# Altium schematic sheet Power.SchDoc
size A; ENG_APP_DATE: --/--/--; DSN_APP_DATE: --/--/--; CHK_APP_DATE: --/--/--; Organization: My Company; Address1: Address Line 1; Address2: Address Line 2; Address3: Address Line 3; Address4: Address Line 4; SheetNumber: 1; SheetTotal: 3
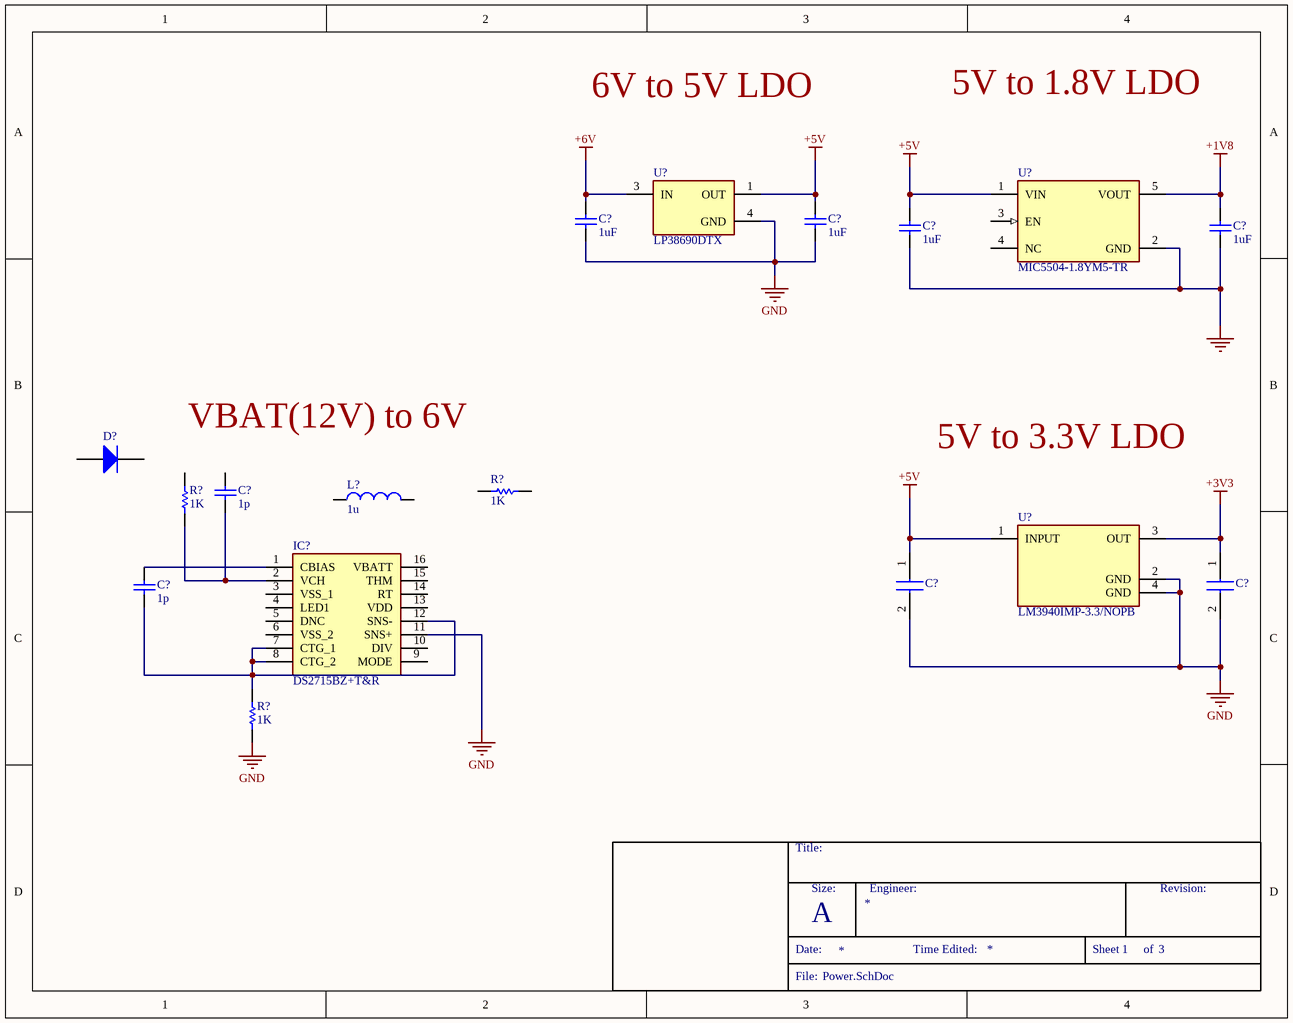
[diagram p0: Power.SchDoc]

## Parts
(Parts that share a designator on the sheet are numbered #1, #2 ... from top to bottom, then left to right.)
C?#1  1uF  [CAPC1608X87X35LL15T15]
C?#2  1uF  [CAPC1608X87X35LL15T15]
C?#3  1uF  [CAPC1608X87X35LL15T15]
C?#4  1uF  [CAPC1608X87X35LL15T15]
C?#5  value 1p  (hidden comment: Capacitor)
C?#6  C2012X5R0J336M125AC  [CAPC2012X145N]  (value not drawn)
C?#7  C2012X5R0J336M125AC  [CAPC2012X145N]  (value not drawn)
C?#8  value 1p  (hidden comment: Capacitor)
D?  Diode  (value not drawn)
IC?  DS2715BZ+T&R  [SOIC127P1032X265-16N]
L?  value 1u  (hidden comment: Inductor)
R?#1  value 1K  (hidden comment: Resistor)
R?#2  value 1K  (hidden comment: Resistor)
R?#3  value 1K  (hidden comment: Resistor)
U?#1  LP38690DTX  [FP-NDP0003B-MFG]
U?#2  MIC5504-1.8YM5-TR  [FP-SOT23-5LD-PL-1-MFG]
U?#3  LM3940IMP-3.3/NOPB  [FP-DCY0004A-MFG]

## Nets
+1V8: C?#4.2 U?#2.5(VOUT)
+3V3: C?#7.1 U?#3.3(OUT)
+5V: C?#2.2 C?#3.2 C?#6.1 U?#1.1(OUT) U?#2.1(VIN) U?#3.1(INPUT)
+6V: C?#1.2 U?#1.3(IN)
GND: C?#1.1 C?#2.1 C?#3.1 C?#4.1 C?#6.2 C?#7.2 IC?.11(SNS+) R?#3.1 U?#1.4(GND) U?#2.2(GND) U?#3.2(GND) U?#3.4(GND)
NetC?#5_1: C?#5.1 IC?.2(VCH) R?#2.1
NetC?#8_1: C?#8.1 IC?.7(CTG_1) IC?.8(CTG_2) IC?.12(SNS-) R?#3.2
NetC?#8_2: C?#8.2 IC?.1(CBIAS)

Not connected (* = marked no-connect by the designer): C?#5 2; D? 1(A) 2(K); IC? 3(VSS_1) 4(LED1) 5(DNC) 6(VSS_2) 9(MODE) 10(DIV) 13(VDD) 14(RT) 15(THM) 16(VBATT); L? 1 2; R?#1 1 2; R?#2 2; U?#2 3(EN) 4(NC)

## Notes on the sheet
- 6V to 5V LDO
- 5V to 1.8V LDO
- VBAT(12V) to 6V
- 5V to 3.3V LDO
- Title:
- Size:
- Engineer:
- Revision:
- Date:
- A
- Time Edited:
- Sheet
- of
- File:

## Library data of the parts
C?#1-C?#4 = CMP-2006-03713-1: Part Number: C0603C105K3RACTU; Manufacturer: Kemet
C?#5 C?#8 = Capacitor: SimulationGenericComponent: True
C?#6 C?#7 = C2012X5R0J336M125AC: Capacitor; Manufacturer_Name: TDK; Datasheet Link: https://product.tdk.com/info/en/catalog/datasheets/mlcc_commercial_midvoltage_en.pdf; Height: 1.45mm; Manufacturer_Part_Number: C2012X5R0J336M125AC; Mouser Part Number: 810-C2012X5R0J336M; Mouser Price/Stock: https://www.mouser.co.uk/ProductDetail/TDK/C2012X5R0J336M125AC?qs=dfay7wIA1uEz8IOrvQUw5Q%3D%3D; Arrow Part Number: C2012X5R0J336M125AC; Arrow Price/Stock: https://www.arrow.com/en/products/c2012x5r0j336m125ac/tdk?region=nac
D? = Diode: AF: 1; BV: 0; BV_MAX: 1e99; EG: 1.11; FC: 0.5; IBV: 0.001; ISR: 1e-14; MJSW: 0.33; NTUN: 30; TNOM: 27; XTI: 3; SimulationGenericComponent: True; CJO: 0; CJP: 0; CTA: 0; CTP: 0; FCS: 0.5; FV_MAX: 1e99; IKF: 0; IKR: 0; JSW: 0; JTUN: 0; JTUNSW: 0; KEG: 1; KF: 0; LEVEL: 1; N: 1; NBV: 1; NR: 1; NS: 1; PHP: 1; RS: 0; TCV: 0; TLEV: 0; TLEVC: 0; TM1: 0; TM2: 0; TPB: 0; TPHP: 0; TRS: 0; TRS2: 0; TT: 0; TTT1: 0; TTT2: 0; VJ: 1; XTITUN: 3; IS: 1e-14
IC? = DS2715BZ+T&R: Integrated Circuit; Manufacturer_Name: Analog Devices; Datasheet Link: https://www.mouser.in/datasheet/2/256/DS2715-1389140.pdf; Height: 2.65mm; Manufacturer_Part_Number: DS2715BZ+T&R; Mouser Part Number: 700-DS2715BZT&R; Mouser Price/Stock: https://www.mouser.co.uk/ProductDetail/Maxim-Integrated/DS2715BZ%2bTR?qs=LHmEVA8xxfZnvZMuot3c2Q%3D%3D
L? = Inductor: SimulationGenericComponent: True
R?#1-R?#3 = Resistor: TC1: 0; SimulationGenericComponent: True; TC2: 0
U?#1 = CMP-04917-000019-1: IC REG LINEAR 3.3V 1A TO252-3 / LP38690DTX-3.3_NOPB; Manufacturer: Texas Instruments; Manufacturer Part Number: LP38690DTX-3.3/NOPB; Max Junction Temp: +125°C; Nominal Supply Current: 55uA; Number Of Outputs: 1; Dropout Voltage: 650mV; Standoff Height: 0.17mm; Accuracy Percentage: 2.5%; Max Supply Voltage: 10V; Min Supply Voltage: 2.7V; Output Type: Fixed; Digikey Description: IC REG LINEAR 3.3V 1A TO252-3; Device Class L1: Integrated Circuits (ICs); Mouser Description: LDO Voltage Regulators 1A LDO CMOS Linear Regs Stable; Device Class L3: Voltage Regulators - Linear; Output Voltage: 3.3V; Lead Free: Yes; ComponentLink2Description: Datasheet; Height: 2.72mm; Temperature Range Low: -40°C; Temperature: -40°C to +125°C; Device Class L2: Power Management ICs; Temperature Range High: +125°C; RoHS: TRUE; Octopart: https://octopart.com/lp38690dtx-3.3%2Fnopb-texas+instruments-24816519; Automotive: No; Category: IC; Output Current: 1A; Package: NDP0003B; ComponentLink2URL: http://www.ti.com/lit/ds/symlink/lp38690.pdf
U?#2 = CMP-06324-000021-1: IC REG LINEAR 1.8V 300MA SOT23-5; Manufacturer: Microchip; Dropout Voltage: 160mV; Number Of Outputs: 1; Nominal Supply Current: 38-42uA; Accuracy Percentage: 2%; Max Supply Voltage: 5.5V; Max Junction Temp: +125°C; Min Supply Voltage: 2.5V; Standoff Height: 0mm; Output Type: Fixed; Temperature Range Low: -40°C; Temperature Range High: +125°C; Automotive: No; Octopart: https://octopart.com/mic5504-1.8ym5-tr-microchip-66803399; RoHS: TRUE; Device Class L1: Integrated Circuits (ICs); Device Class L3: Voltage Regulators - Linear; Package: SOT23-5LD-PL-1; Device Class L2: Power Management ICs; Output Current: 300mA; Digikey Description: IC REG LINEAR 1.8V 300MA SOT23-5; Lead Free: Yes; Output Voltage: 1.8V; Height: 1.45mm; Category: IC; ComponentLink2Description: Datasheet; Temperature: -40°C to +125°C; ComponentLink2URL: http://ww1.microchip.com/downloads/en/DeviceDoc/MIC5501-02-03-04-300mA-Single-Output-LDO-in-Small-Packages-DS20006006B.pdf; Manufacturer Part Number: MIC5504-1.8YM5-TR
U?#3 = CMP-0062-01788-4: IC REG LINEAR 3.3V 1A SOT223-4; Min Input Voltage: 4.5V; Max Supply Voltage: 7.5V; Number of Outputs: 1; Output Type: Fixed; Polarity: Positive; Dropout Voltage: 500mV; Quiescent Current: 15mA; Max Output Voltage: 3.3V; Length: 6.5mm; Termination: SMD/SMT; Width: 3.56mm; Min Supply Voltage: 4.5V; Max Output Current: 1A; Case/Package: SOT-223; Output Voltage: 3.3V; Current Rating: 1A; Packaging: Tape and Reel; Lead Free: Lead Free; Nominal Output Voltage: 3.3V; Height: 1.6mm; Series: -; Output Configuration: Positive; Radiation Hardening: No; Number of Regulators: 1; Package Quantity: 1000; REACH SVHC: No SVHC; Max Input Voltage: 7.5V; Max Operating Temperature: 125°C; Min Operating Temperature: -40°C; Output Current: 1A; Contact Plating: Tin; Number of Pins: 4; Mount: Surface Mount